# Altium project WS100.PrjPCB
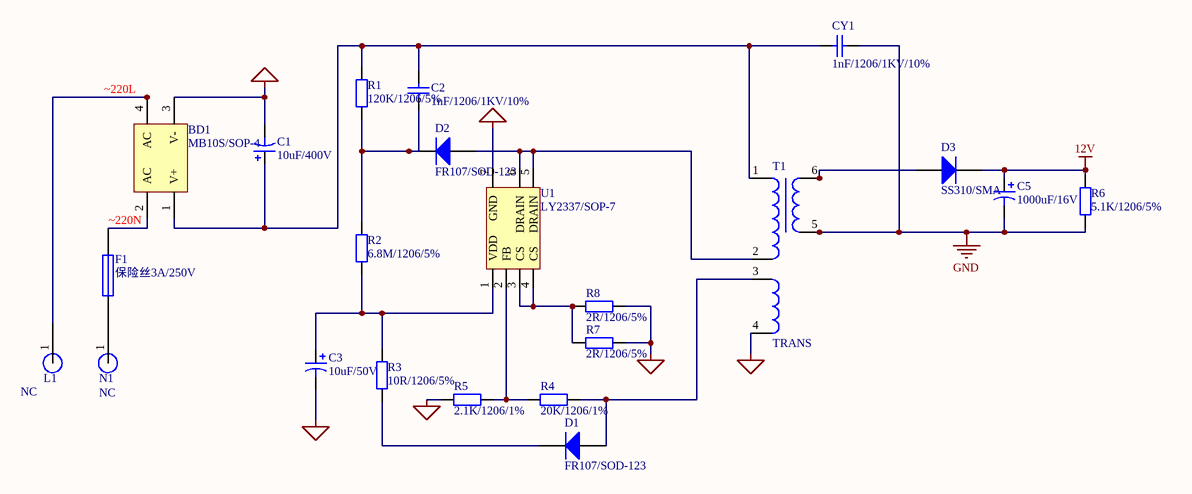
[diagram p0: WS100.SchDoc]
1 sheet, 22 parts. Net scope: global (net labels, ports and power ports of the same name join across sheets).
Board file: WS100R06.PcbDoc

## Sheet WS100.SchDoc
size A4

### Parts
BD1  MB10S/SOP-4  [MBL10S]
C1  10uF/400V  [400V/10uF 8*12mm]
C2  1nF/1206/1KV/10%  [C1206]
C3  10uF/50V  [50V/10uF]
C5  1000uF/16V  [16V/1000uF 8*16mm -2]
CY1  1nF/1206/1KV/10%  [C1206]
D1  FR107/SOD-123  [SOD123]
D2  FR107/SOD-123  [SOD123]
D3  SS310/SMA  [SMA]
F1  保险丝3A/250V  [方块保险丝4*8mm]
L1  NC  [PAD]
N1  NC  [PAD]
R1  120K/1206/5%  [R1206]
R2  6.8M/1206/5%  [R1206]
R3  10R/1206/5%  [R1206]
R4  20K/1206/1%  [R1206]
R5  2.1K/1206/1%  [R1206]
R6  5.1K/1206/5%  [R1206]
R7  2R/1206/5%  [R1206]
R8  2R/1206/5%  [R1206]
T1  TRANS  [EPC-17_2]
U1  LY2337/SOP-7  [SOP-7]

### Nets
12V: C5.1 D3.2(K) R6.2
AGND: BD1.3(V-) C1.2 C3.2 R5.1 R7.2 R8.2 T1.4 U1.7(GND)
GND: C5.2 CY1.2 R6.1 T1.5
~220L: BD1.4(AC) L1.1
~220N: BD1.2(AC) F1.2
NetBD1_1: BD1.1(V+) C1.1 C2.2 CY1.1 R1.2 T1.1
NetC2_1: C2.1 D2.2(K) R1.1 R2.2
NetC3_1: C3.1 R2.1 R3.1 U1.1(VDD)
NetD1_1: D1.1(A) R4.2 T1.3
NetD1_2: D1.2(K) R3.2
NetD2_1: D2.1(A) T1.2 U1.5(DRAIN) U1.6(DRAIN)
NetD3_1: D3.1(A) T1.6
NetF1_1: F1.1 N1.1
NetR4_1: R4.1 R5.2 U1.2(FB)
NetR7_1: R7.1 R8.1 U1.3(CS) U1.4(CS)

### Library data of the parts
BD1 = Bridge2: 整流桥 MB10S/SOP-4; Published: 24-Mar-1999; LatestRevisionDate: 17-Jul-2002; LatestRevisionNote: Re-released for DXP Platform.; PackageReference: D-46_6A; Publisher: Altium Limited; PackageDescription: Bridge Rectifier; 4 Terminals; Body 16.8 x 16.8 mm (typ); Pitch 10.67 mm
C1 = Cap Pol1: 直插电解电容10uF/400V; Published: 8-Jun-2000; LatestRevisionDate: 17-Jul-2002; LatestRevisionNote: Re-released for DXP Platform.; PackageReference: RB7.6-15; Publisher: Altium Limited; PackageDescription: Polarized Capacitor (Radial); 2 Leads; Value: ?
C2 CY1 = Cap: 1nF/1206/50V/10%; Published: 8-Jun-2000; LatestRevisionDate: 17-Jul-2002; LatestRevisionNote: Re-released for DXP Platform.; PackageReference: RAD-0.3; Publisher: Altium Limited; PackageDescription: Radial Cap, Thru-Hole; 2 Leads; 0.3 in Pin Spacing; Value: ?
C3 = Cap Pol1: 直插电解电容10uF/50V; Published: 8-Jun-2000; LatestRevisionDate: 17-Jul-2002; LatestRevisionNote: Re-released for DXP Platform.; PackageReference: RB7.6-15; Publisher: Altium Limited; PackageDescription: Polarized Capacitor (Radial); 2 Leads; Value: ?
C5 = Cap Pol1: 直插电解电容1000uF/16V; Published: 8-Jun-2000; LatestRevisionDate: 17-Jul-2002; LatestRevisionNote: Re-released for DXP Platform.; PackageReference: RB7.6-15; Publisher: Altium Limited; PackageDescription: Polarized Capacitor (Radial); 2 Leads; Value: ?
D1 D2 = Diode: 快恢复二极管 FR107 封装SOD-123; Published: 8-Jun-2000; LatestRevisionDate: 17-Jul-2002; LatestRevisionNote: Re-released for DXP Platform.; PackageVersion: Sep-1996; PackageReference: SMC; Publisher: Altium Limited; PackageDescription: DO-214-AB/SMC; 2 C-Bend Leads; Body 7.9 x 5.9 mm, inc. leads (LxW); Code_JEDEC: DO-214-AB
D3 = Diode: 肖特基二极管 SS310/封装 SMA; Published: 8-Jun-2000; LatestRevisionDate: 17-Jul-2002; LatestRevisionNote: Re-released for DXP Platform.; PackageVersion: Sep-1996; PackageReference: SMC; Publisher: Altium Limited; PackageDescription: DO-214-AB/SMC; 2 C-Bend Leads; Body 7.9 x 5.9 mm, inc. leads (LxW); Code_JEDEC: DO-214-AB
F1 = Fuse 1: Published: 8-Jun-2000; LatestRevisionDate: 17-Jul-2002; LatestRevisionNote: Re-released for DXP Platform.; PackageReference: PIN-W2/E2.8; Publisher: Altium Limited; PackageDescription: Thru-Hole; 2 Leads
L1 N1 = Welding-hole: 焊接点
R1 = Res2: Resistor 120K/1206/5%; Value: 1K; Published: 8-Jun-2000; LatestRevisionDate: 17-Jul-2002; LatestRevisionNote: Re-released for DXP Platform.; PackageReference: AXIAL-0.4; Publisher: Altium Limited; PackageDescription: Axial Device, Thru-Hole; 2 Leads; 0.4 in Pin Spacing
R2 = Res2: Resistor 6.8M/1206/5%  6.8兆欧姆; Value: 1K; Published: 8-Jun-2000; LatestRevisionDate: 17-Jul-2002; LatestRevisionNote: Re-released for DXP Platform.; PackageReference: AXIAL-0.4; Publisher: Altium Limited; PackageDescription: Axial Device, Thru-Hole; 2 Leads; 0.4 in Pin Spacing
R3 = Res2: Resistor 10R/1206/5%; Value: 1K; Published: 8-Jun-2000; LatestRevisionDate: 17-Jul-2002; LatestRevisionNote: Re-released for DXP Platform.; PackageReference: AXIAL-0.4; Publisher: Altium Limited; PackageDescription: Axial Device, Thru-Hole; 2 Leads; 0.4 in Pin Spacing
R4 = Res2: Resistor 20K/1206/1%; Value: 1K; Published: 8-Jun-2000; LatestRevisionDate: 17-Jul-2002; LatestRevisionNote: Re-released for DXP Platform.; PackageReference: AXIAL-0.4; Publisher: Altium Limited; PackageDescription: Axial Device, Thru-Hole; 2 Leads; 0.4 in Pin Spacing
R5 = Res2: Resistor 2.1K/1206/1%; Value: 1K; Published: 8-Jun-2000; LatestRevisionDate: 17-Jul-2002; LatestRevisionNote: Re-released for DXP Platform.; PackageReference: AXIAL-0.4; Publisher: Altium Limited; PackageDescription: Axial Device, Thru-Hole; 2 Leads; 0.4 in Pin Spacing
R6 = Res2: Resistor 5.1K/1206/5%; Value: 1K; Published: 8-Jun-2000; LatestRevisionDate: 17-Jul-2002; LatestRevisionNote: Re-released for DXP Platform.; PackageReference: AXIAL-0.4; Publisher: Altium Limited; PackageDescription: Axial Device, Thru-Hole; 2 Leads; 0.4 in Pin Spacing
R7 R8 = Res2: Resistor 2R/1206/5%; Value: 1K; Published: 8-Jun-2000; LatestRevisionDate: 17-Jul-2002; LatestRevisionNote: Re-released for DXP Platform.; PackageReference: AXIAL-0.4; Publisher: Altium Limited; PackageDescription: Axial Device, Thru-Hole; 2 Leads; 0.4 in Pin Spacing
T1 = TRANS: 变压器
U1 = Component_1